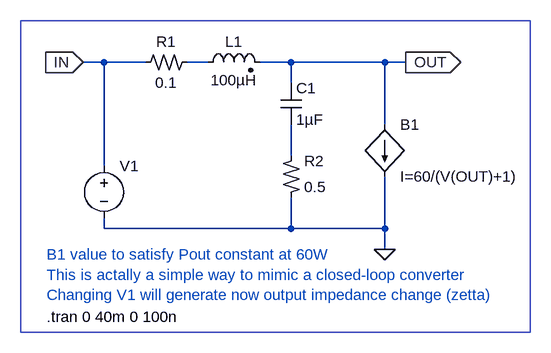
[diagram p0: schematic Switch-Mode Power Supplies - Basso- Figure 1-54.asc]
Switch-Mode Power Supplies - Basso- Figure 1-54.asc, the LTspice schematic file:
Version 4
SHEET 1 880 1052
WIRE -1888 -832 -1920 -832
WIRE -1824 -832 -1888 -832
WIRE -1728 -832 -1760 -832
WIRE -1600 -832 -1648 -832
WIRE -1456 -832 -1600 -832
WIRE -1424 -832 -1456 -832
WIRE -1600 -800 -1600 -832
WIRE -1456 -736 -1456 -832
WIRE -1600 -688 -1600 -736
WIRE -1888 -672 -1888 -832
WIRE -1888 -576 -1888 -592
WIRE -1600 -576 -1600 -624
WIRE -1600 -576 -1888 -576
WIRE -1456 -576 -1456 -656
WIRE -1456 -576 -1600 -576
WIRE -1456 -544 -1456 -576
FLAG -1456 -544 0
FLAG -1424 -832 OUT
IOPIN -1424 -832 Out
FLAG -1920 -832 IN
IOPIN -1920 -832 In
SYMBOL voltage -1888 -688 R0
WINDOW 123 24 44 Left 0
WINDOW 39 0 0 Left 0
WINDOW 3 -97 133 Invisible 0
SYMATTR Value PWL(2m 150 2.000001m 130 5m 130 5.000001m 120 10m 120 10.000001m 102 20m 102 20.000001m 99 30m 99 30.000001m 94.36)
SYMATTR InstName V1
SYMBOL bi -1456 -736 R0
SYMATTR InstName B1
SYMATTR Value I=60/(V(OUT)+1)
SYMBOL res2 -1760 -848 R90
WINDOW 0 0 32 VBottom 0
WINDOW 3 32 32 VTop 0
SYMATTR InstName R1
SYMATTR Value 0.1
SYMBOL ind2 -1744 -816 R270
WINDOW 0 32 56 VTop 0
WINDOW 3 4 56 VBottom 0
SYMATTR InstName L1
SYMATTR Value 100µH
SYMBOL res2 -1616 -624 M180
WINDOW 0 36 56 Left 0
WINDOW 3 36 16 Left 0
SYMATTR InstName R2
SYMATTR Value 0.5
SYMBOL cap -1616 -800 R0
SYMATTR InstName C1
SYMATTR Value 1µF
TEXT -1976 -440 Left 0 !.tran 0 40m 0 100n
TEXT -1976 -536 Left 0 ;B1 value to satisfy Pout constant at 60W\nThis is actally a simple way to mimic a closed-loop converter\nChanging V1 will generate now output impedance change (zetta)
RECTANGLE Normal -2016 -896 -1232 -416

The netlist it stands for:
* Switch-Mode Power Supplies - Basso- Figure 1-54.asc
V1 IN 0 PWL(2m 150 2.000001m 130 5m 130 5.000001m 120 10m 120 10.000001m 102 20m 102 20.000001m 99 30m 99 30.000001m 94.36)
B1 OUT 0 I=60/(V(OUT)+1)
R1 N001 IN 0.1
L1 N001 OUT 100µH
R2 0 N002 0.5
C1 OUT N002 1µF
.tran 0 40m 0 100n
* B1 value to satisfy Pout constant at 60W
* This is actally a simple way to mimic a closed-loop converter
* Changing V1 will generate now output impedance change (zetta)
.backanno
.end